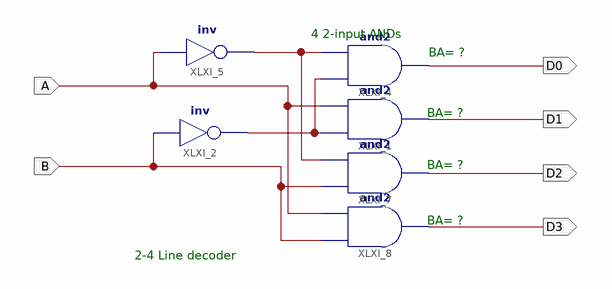
[diagram p0: schematic sheet 1]
// Xilinx ISE schematic Decoder_24.sch (spartan3) as structural Verilog: 6 symbols, 6 ports
module Decoder_24 (
  input  B,
  input  A,
  output D0,
  output D1,
  output D3,
  output D2
);

  wire XLXN_79, XLXN_80;

  and XLXI_1 (D1, XLXN_79, A);
  and XLXI_8 (D3, B, A);
  and XLXI_7 (D2, B, XLXN_80);
  and XLXI_4 (D0, XLXN_79, XLXN_80);
  not XLXI_5 (XLXN_80, A);
  not XLXI_2 (XLXN_79, B);

  // Notes on the sheet:
  //   4 2-input ANDs
  //   BA= ?
  //   BA= ?
  //   BA= ?
  //   BA= ?
  //   2-4 Line decoder
endmodule
